# Altium project CAN_Test_Runner.PrjPcb
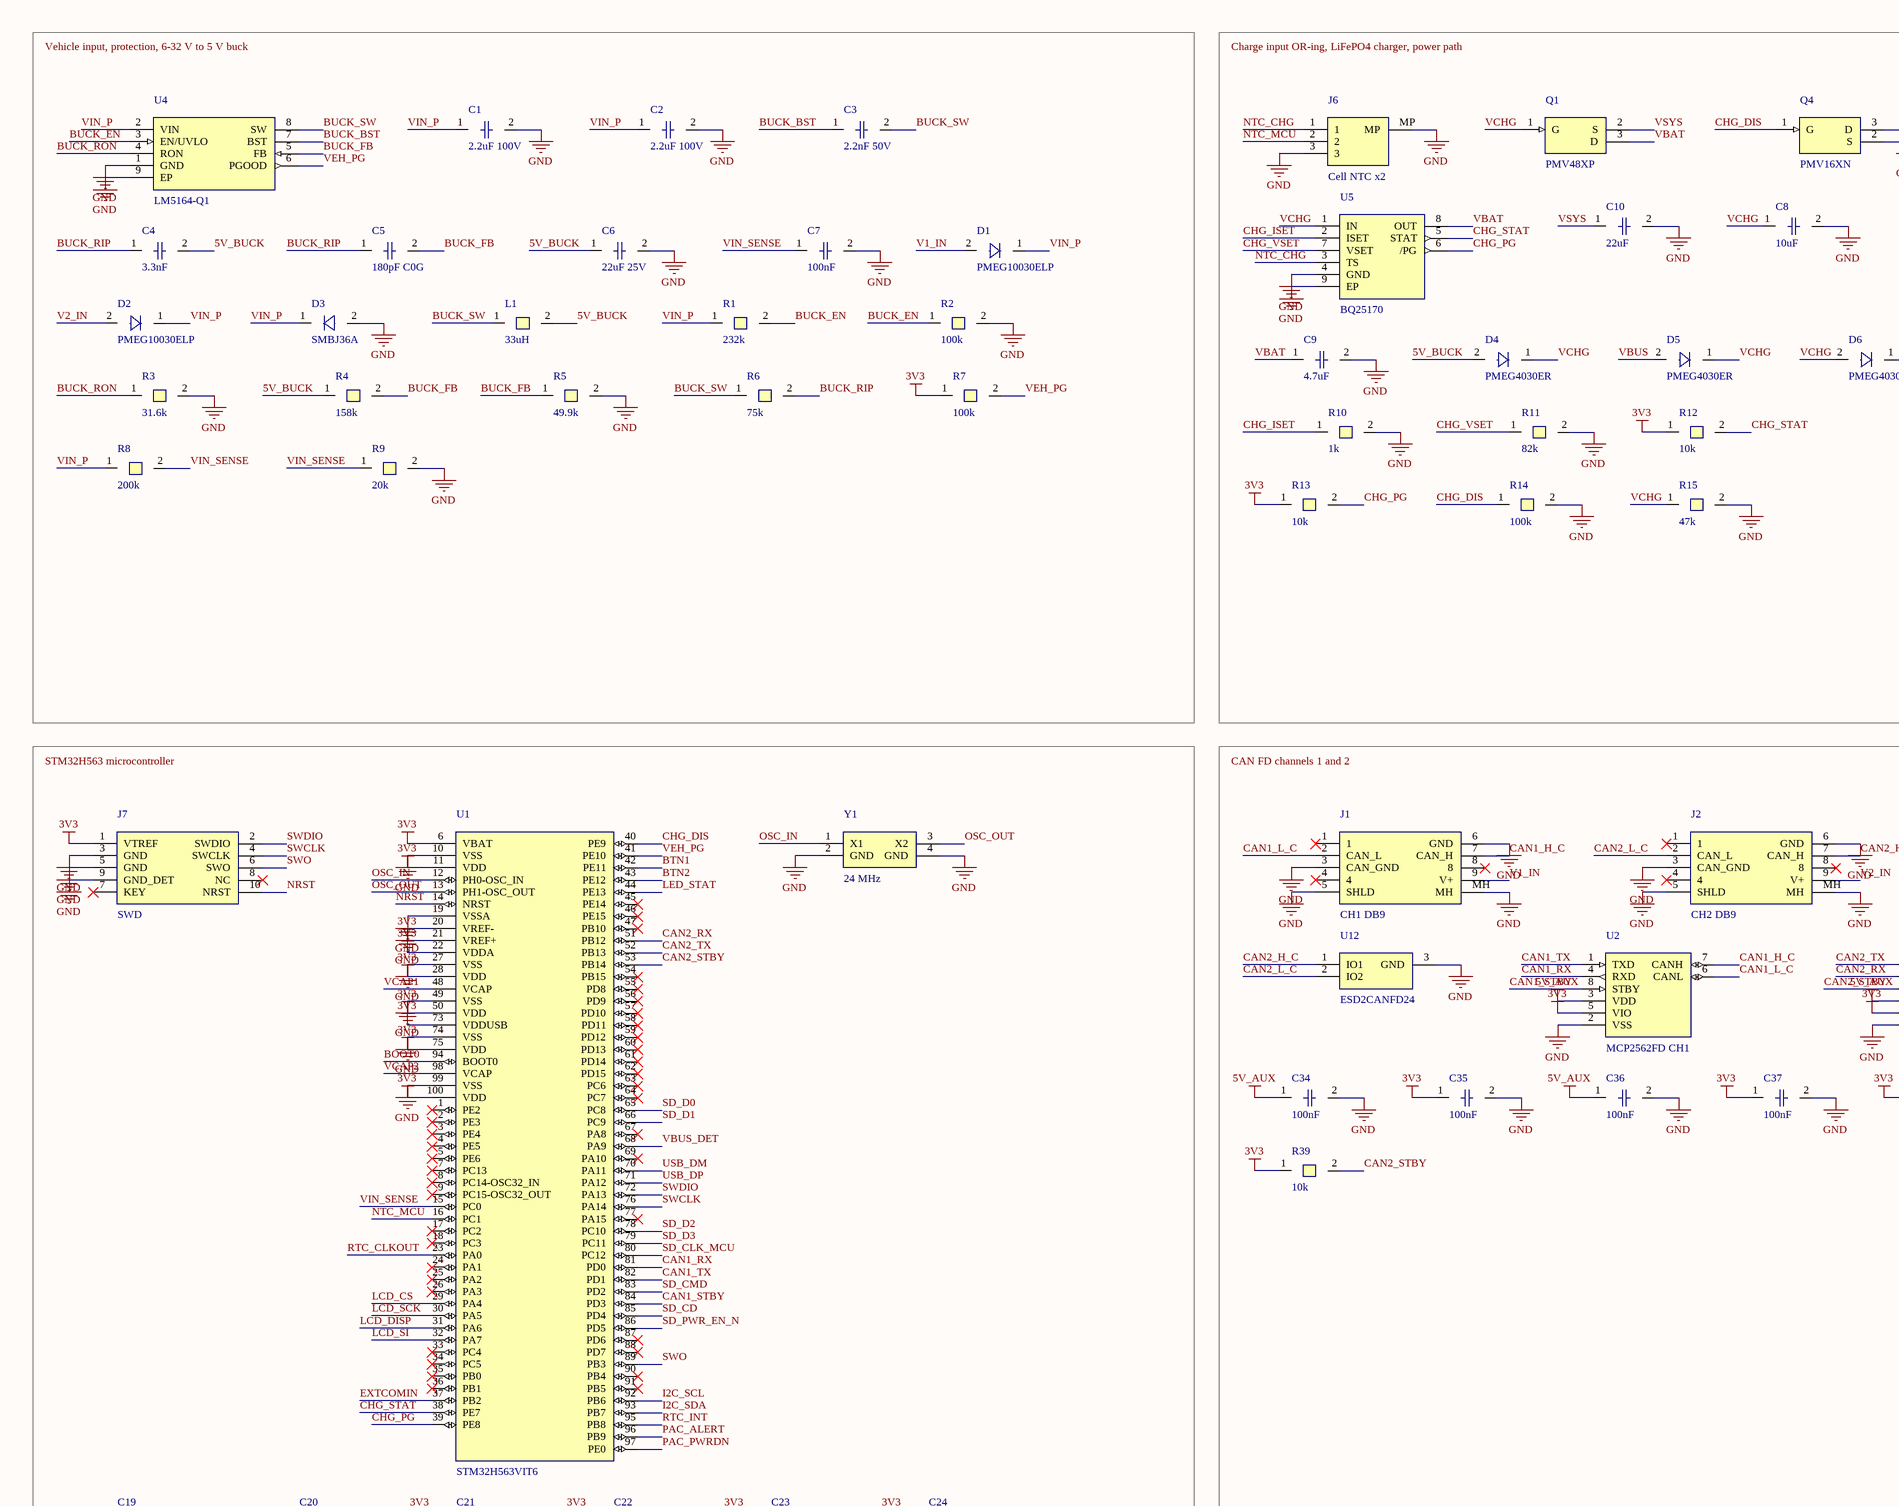
[diagram p0: CAN_Test_Runner.SchDoc, top left]
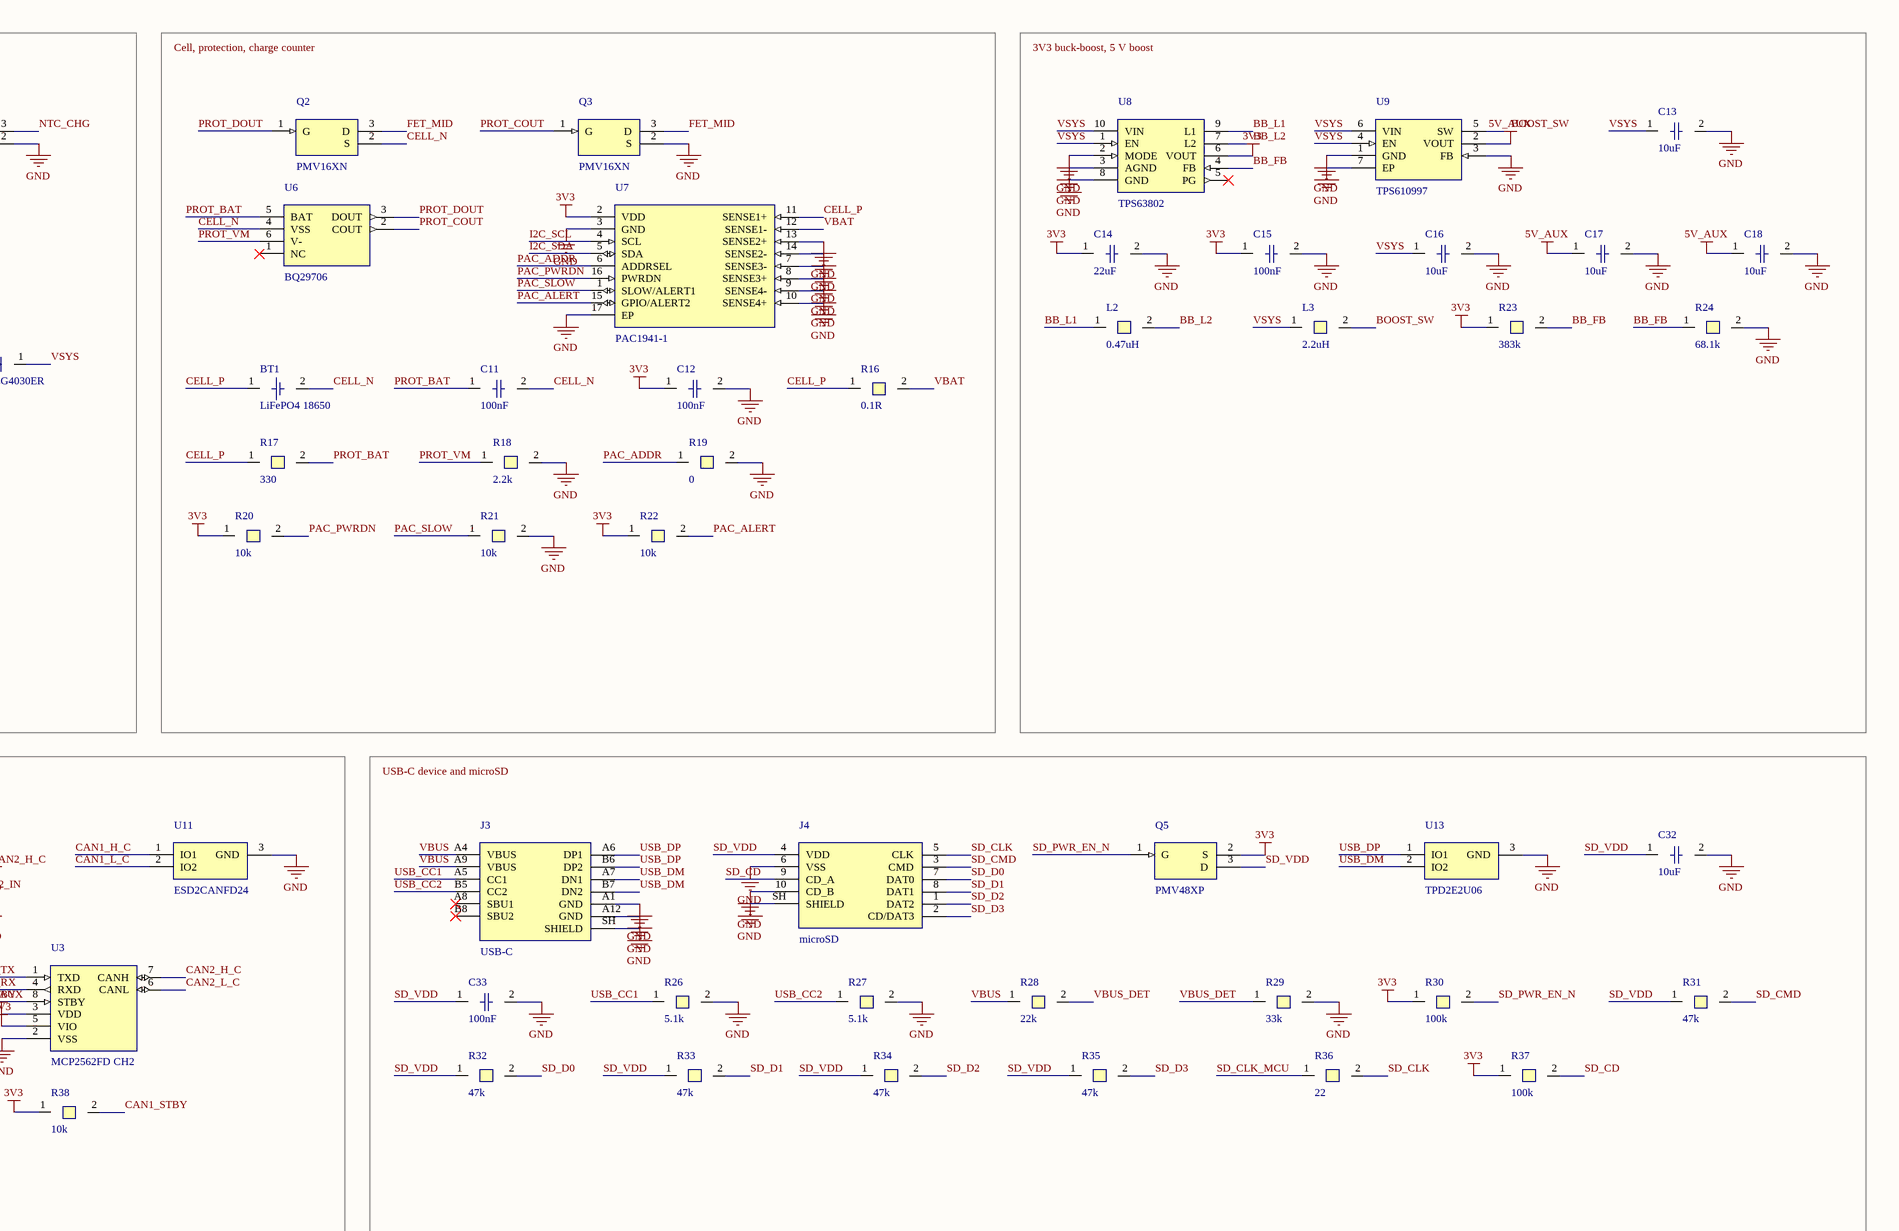
[diagram p1: CAN_Test_Runner.SchDoc, top right]
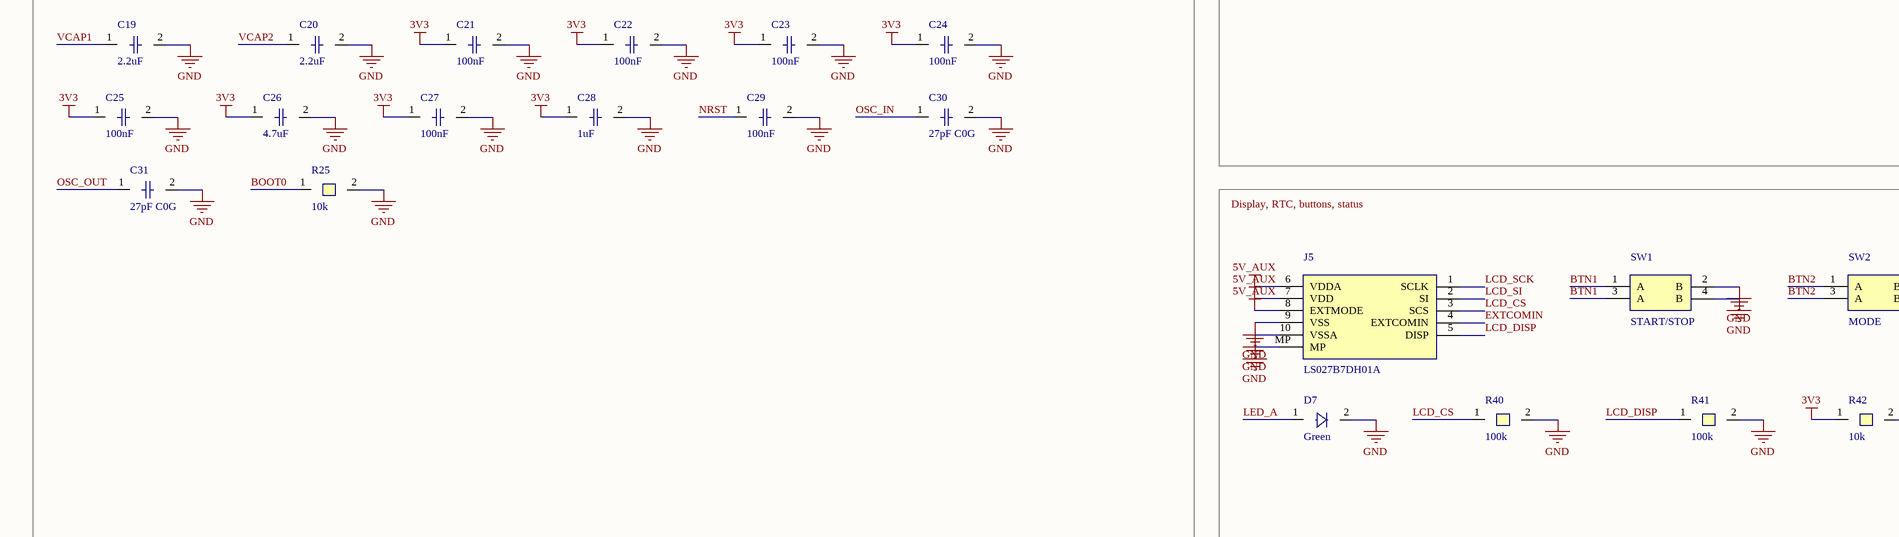
[diagram p2: CAN_Test_Runner.SchDoc, bottom left]
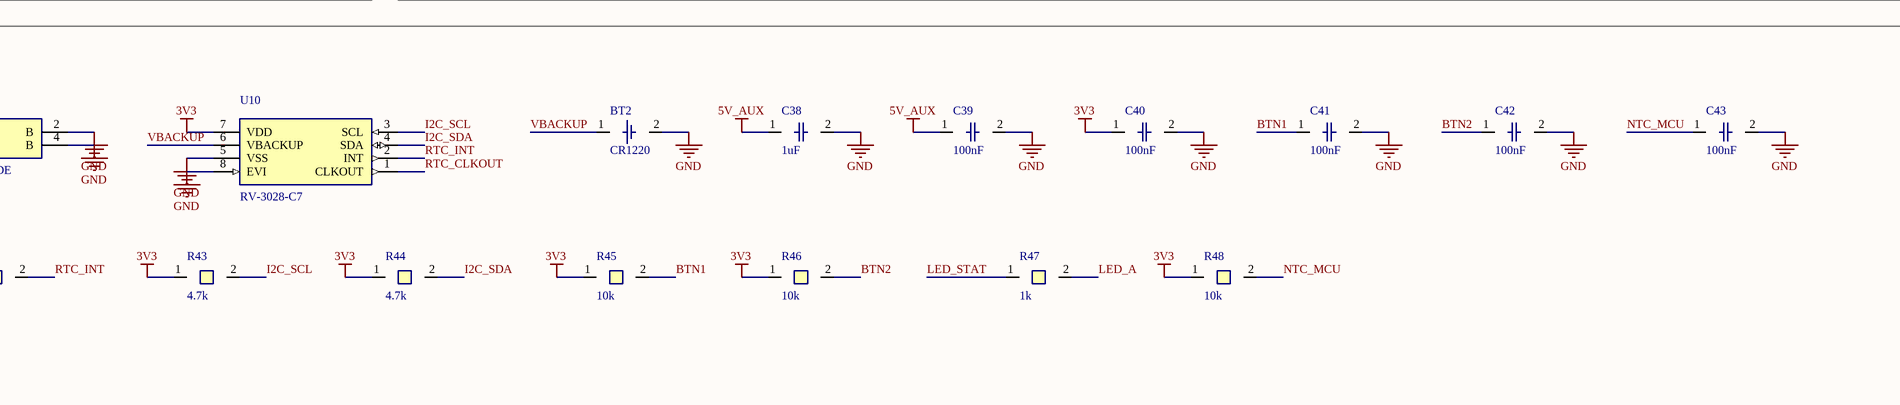
[diagram p3: CAN_Test_Runner.SchDoc, bottom right]
1 sheet, 131 parts. Net scope: global (net labels, ports and power ports of the same name join across sheets).
Board file: CAN_Test_Runner.PcbDoc

## Sheet CAN_Test_Runner.SchDoc
size A1; SheetNumber: 2; SheetTotal: 2

### Parts
BT1  LiFePO4 18650  [BATT_KEYSTONE_1042_18650]
BT2  CR1220  [BATT_KEYSTONE_3000_12MM]
C1  2.2uF 100V  [C1210]
C2  2.2uF 100V  [C1210]
C3  2.2nF 50V  [C0603]
C4  3.3nF  [C0603]
C5  180pF C0G  [C0603]
C6  22uF 25V  [C1210]
C7  100nF  [C0603]
C8  10uF  [C0805]
C9  4.7uF  [C0805]
C10  22uF  [C1210]
C11  100nF  [C0603]
C12  100nF  [C0603]
C13  10uF  [C0805]
C14  22uF  [C0805]
C15  100nF  [C0603]
C16  10uF  [C0805]
C17  10uF  [C0805]
C18  10uF  [C0805]
C19  2.2uF  [C0603]
C20  2.2uF  [C0603]
C21  100nF  [C0603]
C22  100nF  [C0603]
C23  100nF  [C0603]
C24  100nF  [C0603]
C25  100nF  [C0603]
C26  4.7uF  [C0805]
C27  100nF  [C0603]
C28  1uF  [C0603]
C29  100nF  [C0603]
C30  27pF C0G  [C0603]
C31  27pF C0G  [C0603]
C32  10uF  [C0805]
C33  100nF  [C0603]
C34  100nF  [C0603]
C35  100nF  [C0603]
C36  100nF  [C0603]
C37  100nF  [C0603]
C38  1uF  [C0603]
C39  100nF  [C0603]
C40  100nF  [C0603]
C41  100nF  [C0603]
C42  100nF  [C0603]
C43  100nF  [C0603]
D1  PMEG10030ELP  [SOD128]
D2  PMEG10030ELP  [SOD128]
D3  SMBJ36A  [SMB]
D4  PMEG4030ER  [SOD123W]
D5  PMEG4030ER  [SOD123W]
D6  PMEG4030ER  [SOD123W]
D7  Green  [LED0603]
J1  CH1 DB9  [DSUB-9_M_WR-DSUB_618009231221]
J2  CH2 DB9  [DSUB-9_M_WR-DSUB_618009231221]
J3  USB-C  [USB-C_GCT_USB4105]
J4  microSD  [MICROSD_HIROSE_DM3AT]
J5  LS027B7DH01A  [FPC_10P_0.5_WR-FPC_687110149022]
J6  Cell NTC x2  [JST_PH_S3B-PH-SM4-TB]
J7  SWD  [TAG-CONNECT_TC2050-IDC-NL]
L1  33uH  [L_WE-LQS-6045]
L2  0.47uH  [L_WE-MAPI-2016]
L3  2.2uH  [L_WE-LQS-2520]
Q1  PMV48XP  [SOT-23-3]
Q2  PMV16XN  [SOT-23-3]
Q3  PMV16XN  [SOT-23-3]
Q4  PMV16XN  [SOT-23-3]
Q5  PMV48XP  [SOT-23-3]
R1  232k  [R0603]
R2  100k  [R0603]
R3  31.6k  [R0603]
R4  158k  [R0603]
R5  49.9k  [R0603]
R6  75k  [R0603]
R7  100k  [R0603]
R8  200k  [R0603]
R9  20k  [R0603]
R10  1k  [R0603]
R11  82k  [R0603]
R12  10k  [R0603]
R13  10k  [R0603]
R14  100k  [R0603]
R15  47k  [R0603]
R16  0.1R  [R0805]
R17  330  [R0603]
R18  2.2k  [R0603]
R19  0  [R0603]
R20  10k  [R0603]
R21  10k  [R0603]
R22  10k  [R0603]
R23  383k  [R0603]
R24  68.1k  [R0603]
R25  10k  [R0603]
R26  5.1k  [R0603]
R27  5.1k  [R0603]
R28  22k  [R0603]
R29  33k  [R0603]
R30  100k  [R0603]
R31  47k  [R0603]
R32  47k  [R0603]
R33  47k  [R0603]
R34  47k  [R0603]
R35  47k  [R0603]
R36  22  [R0603]
R37  100k  [R0603]
R38  10k  [R0603]
R39  10k  [R0603]
R40  100k  [R0603]
R41  100k  [R0603]
R42  10k  [R0603]
R43  4.7k  [R0603]
R44  4.7k  [R0603]
R45  10k  [R0603]
R46  10k  [R0603]
R47  1k  [R0603]
R48  10k  [R0603]
SW1  START/STOP  [SW_WS-TASV_6x6]
SW2  MODE  [SW_WS-TASV_6x6]
U1  STM32H563VIT6  [LQFP-100_14x14]
U2  MCP2562FD CH1  [SOIC-8_150MIL]
U3  MCP2562FD CH2  [SOIC-8_150MIL]
U4  LM5164-Q1  [SOIC-8_DDA_PowerPAD]
U5  BQ25170  [WSON-8_DSG]
U6  BQ29706  [WSON-6_DSE]
U7  PAC1941-1  [VQFN-16_3x3_4MX]
U8  TPS63802  [VSON-10_DLA]
U9  TPS610997  [WSON-6_DRV]
U10  RV-3028-C7  [RV-3028-C7]
U11  ESD2CANFD24  [SOT-23-3]
U12  ESD2CANFD24  [SOT-23-3]
U13  TPD2E2U06  [SC-70-3]
Y1  24 MHz  [XTAL_3225_4P]

### Blocks framed on the sheet
Vehicle input, protection, 6-32 V to 5 V buck: C1-C7 D1-D3 L1 R1-R9 U4
Charge input OR-ing, LiFePO4 charger, power path: C8-C10 D4-D6 J6 Q1 Q4 R10-R15 U5
Cell, protection, charge counter: BT1 C11 C12 Q2 Q3 R16-R22 U6 U7
3V3 buck-boost, 5 V boost: C13-C18 L2 L3 R23 R24 U8 U9
STM32H563 microcontroller: C19-C31 J7 R25 U1 Y1
CAN FD channels 1 and 2: C34-C37 J1 J2 R38 R39 U2 U3 U11 U12
USB-C device and microSD: C32 C33 J3 J4 Q5 R26-R37 U13
Display, RTC, buttons, status: BT2 C38-C43 D7 J5 R40-R48 SW1 SW2 U10

### Nets
3V3: C12.1 C14.1 C15.1 C21.1 C22.1 C23.1 C24.1 C25.1 C26.1 C27.1 C28.1 C35.1 C37.1 C40.1 J7.1(VTREF) Q5.2(S) R7.1 R12.1 R13.1 R20.1 R22.1 R23.1 R30.1 R37.1 R38.1 R39.1 R42.1 R43.1 R44.1 R45.1 R46.1 R48.1 U1.6(VBAT) U1.11(VDD) U1.21(VREF+) U1.22(VDDA) U1.28(VDD) U1.50(VDD) U1.73(VDDUSB) U1.75(VDD) U1.100(VDD) U2.5(VIO) U3.5(VIO) U7.2(VDD) U8.6(VOUT) U10.7(VDD)
5V_AUX: C17.1 C18.1 C34.1 C36.1 C38.1 C39.1 J5.6(VDDA) J5.7(VDD) J5.8(EXTMODE) U2.3(VDD) U3.3(VDD) U9.2(VOUT)
GND: BT2.2(-) C1.2 C2.2 C6.2 C7.2 C8.2 C9.2 C10.2 C12.2 C13.2 C14.2 C15.2 C16.2 C17.2 C18.2 C19.2 C20.2 C21.2 C22.2 C23.2 C24.2 C25.2 C26.2 C27.2 C28.2 C29.2 C30.2 C31.2 C32.2 C33.2 C34.2 C35.2 C36.2 C37.2 C38.2 C39.2 C40.2 C41.2 C42.2 C43.2 D3.2(A) D7.2(K) J1.3(CAN_GND) J1.5(SHLD) J1.6(GND) J1.MH J2.3(CAN_GND) J2.5(SHLD) J2.6(GND) J2.MH J3.A1(GND) J3.A12(GND) J3.SH(SHIELD) J4.6(VSS) J4.10(CD_B) J4.SH(SHIELD) J5.9(VSS) J5.10(VSSA) J5.MP J6.3 J6.MP J7.3(GND) J7.5(GND) J7.9(GND_DET) Q3.2(S) Q4.2(S) R2.2 R3.2 R5.2 R9.2 R10.2 R11.2 R14.2 R15.2 R18.2 R19.2 R21.2 R24.2 R25.2 R26.2 R27.2 R29.2 R40.2 R41.2 SW1.2(B) SW1.4(B) SW2.2(B) SW2.4(B) U1.10(VSS) U1.19(VSSA) U1.20(VREF-) U1.27(VSS) U1.49(VSS) U1.74(VSS) U1.99(VSS) U2.2(VSS) U3.2(VSS) U4.1(GND) U4.9(EP) U5.4(GND) U5.9(EP) U7.3(GND) U7.7(SENSE3-) U7.8(SENSE3+) U7.9(SENSE4-) U7.10(SENSE4+) U7.13(SENSE2+) U7.14(SENSE2-) U7.17(EP) U8.2(MODE) U8.3(AGND) U8.8(GND) U9.1(GND) U9.3(FB) U9.7(EP) U10.5(VSS) U10.8(EVI) U11.3(GND) U12.3(GND) U13.3(GND) Y1.2(GND) Y1.4(GND)
5V_BUCK: C4.2 C6.1 D4.2(A) L1.2 R4.1
BB_FB: R23.2 R24.1 U8.4(FB)
BB_L1: L2.1 U8.9(L1)
BB_L2: L2.2 U8.7(L2)
BOOST_SW: L3.2 U9.5(SW)
BOOT0: R25.1 U1.94(BOOT0)
BTN1: C41.1 R45.2 SW1.1(A) SW1.3(A) U1.42(PE11)
BTN2: C42.1 R46.2 SW2.1(A) SW2.3(A) U1.43(PE12)
BUCK_BST: C3.1 U4.7(BST)
BUCK_EN: R1.2 R2.1 U4.3(EN/UVLO)
BUCK_FB: C5.2 R4.2 R5.1 U4.5(FB)
BUCK_RIP: C4.1 C5.1 R6.2
BUCK_RON: R3.1 U4.4(RON)
BUCK_SW: C3.2 L1.1 R6.1 U4.8(SW)
CAN1_H_C: J1.7(CAN_H) U2.7(CANH) U11.1(IO1)
CAN1_L_C: J1.2(CAN_L) U2.6(CANL) U11.2(IO2)
CAN1_RX: U1.81(PD0) U2.4(RXD)
CAN1_STBY: R38.2 U1.84(PD3) U2.8(STBY)
CAN1_TX: U1.82(PD1) U2.1(TXD)
CAN2_H_C: J2.7(CAN_H) U3.7(CANH) U12.1(IO1)
CAN2_L_C: J2.2(CAN_L) U3.6(CANL) U12.2(IO2)
CAN2_RX: U1.51(PB12) U3.4(RXD)
CAN2_STBY: R39.2 U1.53(PB14) U3.8(STBY)
CAN2_TX: U1.52(PB13) U3.1(TXD)
CELL_N: BT1.2(-) C11.2 Q2.2(S) U6.4(VSS)
CELL_P: BT1.1(+) R16.1 R17.1 U7.11(SENSE1+)
CHG_DIS: Q4.1(G) R14.1 U1.40(PE9)
CHG_ISET: R10.1 U5.2(ISET)
CHG_PG: R13.2 U1.39(PE8) U5.6(/PG)
CHG_STAT: R12.2 U1.38(PE7) U5.5(STAT)
CHG_VSET: R11.1 U5.7(VSET)
EXTCOMIN: J5.4(EXTCOMIN) U1.37(PB2)
FET_MID: Q2.3(D) Q3.3(D)
I2C_SCL: R43.2 U1.92(PB6) U7.4(SCL) U10.3(SCL)
I2C_SDA: R44.2 U1.93(PB7) U7.5(SDA) U10.4(SDA)
LCD_CS: J5.3(SCS) R40.1 U1.29(PA4)
LCD_DISP: J5.5(DISP) R41.1 U1.31(PA6)
LCD_SCK: J5.1(SCLK) U1.30(PA5)
LCD_SI: J5.2(SI) U1.32(PA7)
LED_A: D7.1(A) R47.2
LED_STAT: R47.1 U1.44(PE13)
NRST: C29.1 J7.10(NRST) U1.14(NRST)
NTC_CHG: J6.1 Q4.3(D) U5.3(TS)
NTC_MCU: C43.1 J6.2 R48.2 U1.16(PC1)
OSC_IN: C30.1 U1.12(PH0-OSC_IN) Y1.1(X1)
OSC_OUT: C31.1 U1.13(PH1-OSC_OUT) Y1.3(X2)
PAC_ADDR: R19.1 U7.6(ADDRSEL)
PAC_ALERT: R22.2 U1.96(PB9) U7.15(GPIO/ALERT2)
PAC_PWRDN: R20.2 U1.97(PE0) U7.16(PWRDN)
PAC_SLOW: R21.1 U7.1(SLOW/ALERT1)
PROT_BAT: C11.1 R17.2 U6.5(BAT)
PROT_COUT: Q3.1(G) U6.2(COUT)
PROT_DOUT: Q2.1(G) U6.3(DOUT)
PROT_VM: R18.1 U6.6(V-)
RTC_CLKOUT: U1.23(PA0) U10.1(CLKOUT)
RTC_INT: R42.2 U1.95(PB8) U10.2(INT)
SD_CD: J4.9(CD_A) R37.2 U1.85(PD4)
SD_CLK: J4.5(CLK) R36.2
SD_CLK_MCU: R36.1 U1.80(PC12)
SD_CMD: J4.3(CMD) R31.2 U1.83(PD2)
SD_D0: J4.7(DAT0) R32.2 U1.65(PC8)
SD_D1: J4.8(DAT1) R33.2 U1.66(PC9)
SD_D2: J4.1(DAT2) R34.2 U1.78(PC10)
SD_D3: J4.2(CD/DAT3) R35.2 U1.79(PC11)
SD_PWR_EN_N: Q5.1(G) R30.2 U1.86(PD5)
SD_VDD: C32.1 C33.1 J4.4(VDD) Q5.3(D) R31.1 R32.1 R33.1 R34.1 R35.1
SWCLK: J7.4(SWCLK) U1.76(PA14)
SWDIO: J7.2(SWDIO) U1.72(PA13)
SWO: J7.6(SWO) U1.89(PB3)
USB_CC1: J3.A5(CC1) R26.1
USB_CC2: J3.B5(CC2) R27.1
USB_DM: J3.A7(DN1) J3.B7(DN2) U1.70(PA11) U13.2(IO2)
USB_DP: J3.A6(DP1) J3.B6(DP2) U1.71(PA12) U13.1(IO1)
V1_IN: D1.2(A) J1.9(V+)
V2_IN: D2.2(A) J2.9(V+)
VBACKUP: BT2.1(+) U10.6(VBACKUP)
VBAT: C9.1 Q1.3(D) R16.2 U5.8(OUT) U7.12(SENSE1-)
VBUS: D5.2(A) J3.A4(VBUS) J3.A9(VBUS) R28.1
VBUS_DET: R28.2 R29.1 U1.68(PA9)
VCAP1: C19.1 U1.48(VCAP)
VCAP2: C20.1 U1.98(VCAP)
VCHG: C8.1 D4.1(K) D5.1(K) D6.2(A) Q1.1(G) R15.1 U5.1(IN)
VEH_PG: R7.2 U1.41(PE10) U4.6(PGOOD)
VIN_P: C1.1 C2.1 D1.1(K) D2.1(K) D3.1(K) R1.1 R8.1 U4.2(VIN)
VIN_SENSE: C7.1 R8.2 R9.1 U1.15(PC0)
VSYS: C10.1 C13.1 C16.1 D6.1(K) L3.1 Q1.2(S) U8.1(EN) U8.10(VIN) U9.4(EN) U9.6(VIN)

Not connected (* = marked no-connect by the designer): J1 1* 4* 8*; J2 1* 4* 8*; J3 A8(SBU1)* B8(SBU2)*; J7 7(KEY)* 8(NC)*; U1 1(PE2)* 2(PE3)* 3(PE4)* 4(PE5)* 5(PE6)* 7(PC13)* 8(PC14-OSC32_IN)* 9(PC15-OSC32_OUT)* 17(PC2)* 18(PC3)* 24(PA1)* 25(PA2)* 26(PA3)* 33(PC4)* 34(PC5)* 35(PB0)* 36(PB1)* 45(PE14)* 46(PE15)* 47(PB10)* 54(PB15)* 55(PD8)* 56(PD9)* 57(PD10)* 58(PD11)* 59(PD12)* 60(PD13)* 61(PD14)* 62(PD15)* 63(PC6)* 64(PC7)* 67(PA8)* 69(PA10)* 77(PA15)* 87(PD6)* 88(PD7)* 90(PB4)* 91(PB5)*; U6 1(NC)*; U8 5(PG)*

### Library data of the parts
BT1 = BATT_18650: 18650 cell holder; MPN: Keystone 1042
BT2 = BATT_COIN: Coin cell retainer; MPN: Keystone 3000
C1 C2 C6 C10 = CAP: Capacitor, non-polarised; MPN: generic 1210 X7R/C0G
C3-C5 C7 C11 C12 C15 C19-C25 C27-C31 C33-C43 = CAP: Capacitor, non-polarised; MPN: generic 0603 X7R/C0G
C8 C9 C13 C14 C16-C18 C26 C32 = CAP: Capacitor, non-polarised; MPN: generic 0805 X7R/C0G
D1 D2 = DIODE_SCHOTTKY: Schottky diode (pad 1 = cathode); MPN: Nexperia PMEG10030ELPX
D3 = TVS_UNI: Unidirectional TVS (pad 1 = cathode); MPN: Bourns SMBJ36A
D4-D6 = DIODE_SCHOTTKY: Schottky diode (pad 1 = cathode); MPN: Nexperia PMEG4030ERX
D7 = LED: MPN: generic 0603 green LED
J1 J2 = DB9_M: DB9 male, CiA 303-1: 2 CAN_L, 3 CAN_GND, 5 SHLD, 6 GND, 7 CAN_H, 9 V+; MPN: Wurth 618009231221
J3 = USB_C: USB-C 2.0 receptacle; MPN: GCT USB4105-GF-A
J4 = MICROSD: microSD push-push with card-detect switch (9/10); MPN: Hirose DM3AT-SF-PEJM5
J5 = FPC10_LCD: 10-pin 0.5 mm FPC, Sharp LS027B7DH01A pin order; MPN: Wurth 687110149022
J6 = CONN3: 3-pin connector; MPN: JST S3B-PH-SM4-TB
J7 = SWD_TC2050: Tag-Connect TC2050, Cortex 10-pin SWD; MPN: Tag-Connect TC2050-IDC-NL (footprint only)
L1 = IND: Inductor; MPN: Wurth 74404064330
L2 = IND: Inductor; MPN: Wurth 744383430047
L3 = IND: Inductor; MPN: Wurth 74404024022
Q1 Q5 = PMOS: P-channel MOSFET, SOT-23; MPN: Nexperia PMV48XP
Q2-Q4 = NMOS: N-channel MOSFET, SOT-23; MPN: Nexperia PMV16XN
R1-R15 R17-R48 = RES: Resistor; MPN: generic 0603 1%
R16 = RES: Resistor; MPN: generic 0805 1%
SW1 SW2 = SW_4P: Tactile switch, pads 1/3 and 2/4 common; MPN: Wurth 430182050816
U1 = STM32H563VIT6: STM32H563VIT6 Cortex-M33 250 MHz, 2 MB flash, 640 KB SRAM, LQFP-100; MPN: ST STM32H563VIT6
U2 U3 = MCP2562FD: CAN FD transceiver with VIO, SOIC-8; MPN: Microchip MCP2562FD-E/SN
U4 = LM5164: LM5164-Q1 100 V 1 A synchronous buck, DDA PowerPAD; MPN: TI LM5164QDDARQ1
U5 = BQ25170: BQ25170 800 mA linear charger, Li-ion / LiFePO4, WSON-8; MPN: TI BQ25170DSGR
U6 = BQ2970: BQ29706 single-cell protector, OVP 3.85 V / UVP 2.5 V, WSON-6; MPN: TI BQ29706DSER
U7 = PAC1941: PAC1941-1 power monitor with charge accumulator, VQFN-16; MPN: Microchip PAC1941T-1E/4MX
U8 = TPS63802: TPS63802 2 A buck-boost, VSON-10; MPN: TI TPS63802DLAR
U9 = TPS61099: TPS610997 5.0 V boost, 1 uA Iq, WSON-6; MPN: TI TPS610997DRVR
U10 = RV3028: RV-3028-C7 RTC module, 45 nA; MPN: Micro Crystal RV-3028-C7 32.768kHz 1ppm-TA-QC
U11 U12 = ESD_CAN: ESD2CANFD24-Q1 CAN FD ESD protection, SOT-23; MPN: TI ESD2CANFD24DBZRQ1
U13 = ESD_2CH: TPD2E2U06 2-channel ESD, SC-70; MPN: TI TPD2E2U06DCKR
Y1 = XTAL_4P: Crystal, 4-pad package, pads 2 and 4 = case; MPN: Abracon ABM8-24.000MHZ-B2-T